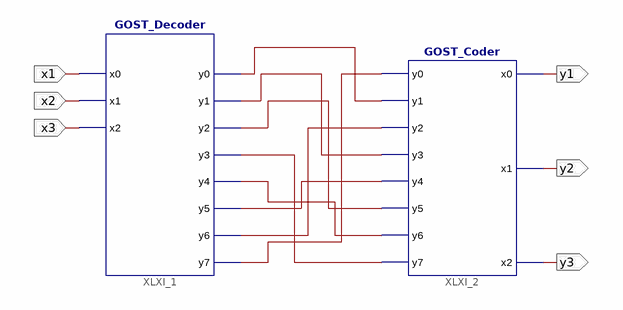
[diagram p0: schematic sheet 1]
// Xilinx ISE schematic SboxGOSTsch.sch (spartan3) as structural Verilog: 2 symbols, 6 ports
module SboxGOSTsch (
  input  x1,
  input  x2,
  input  x3,
  output y1,
  output y2,
  output y3
);

  wire XLXN_63, XLXN_66, XLXN_67, XLXN_68, XLXN_69, XLXN_70, XLXN_71, XLXN_72;

  GOST_Decoder XLXI_1 (
    .x0(x1), .x1(x2), .x2(x3), .y0(XLXN_72), .y1(XLXN_71), .y2(XLXN_70), .y3(XLXN_69), .y4(XLXN_68),
    .y5(XLXN_67), .y6(XLXN_66), .y7(XLXN_63));
  GOST_Coder XLXI_2 (
    .y0(XLXN_63), .y1(XLXN_72), .y2(XLXN_66), .y3(XLXN_71), .y4(XLXN_67), .y5(XLXN_70), .y6(XLXN_68),
    .y7(XLXN_69), .x0(y1), .x1(y2), .x2(y3));
endmodule
